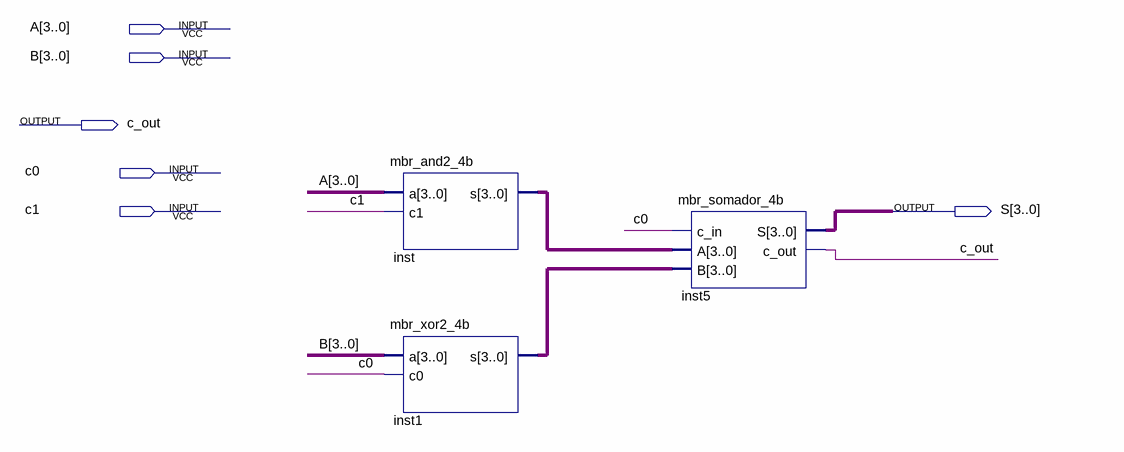
[diagram p0: schematic sheet]
// Quartus schematic mbr_bloco_arit_4b - Copia.bdf as structural Verilog: 3 symbols, 6 pins
module \mbr_bloco_arit_4b_-_Copia  (
  input  [3:0] A,
  input  [3:0] B,
  input  c0,
  input  c1,
  output c_out,
  output [3:0] S
);

  wire [3:0] inst1_s, inst_s;

  mbr_and2_4b inst (.a(A), .c1(c1), .s(inst_s));
  mbr_xor2_4b inst1 (.a(B), .c0(c0), .s(inst1_s));
  mbr_somador_4b inst5 (.c_in(c0), .A(inst_s), .B(inst1_s), .S(S), .c_out(c_out));
endmodule
